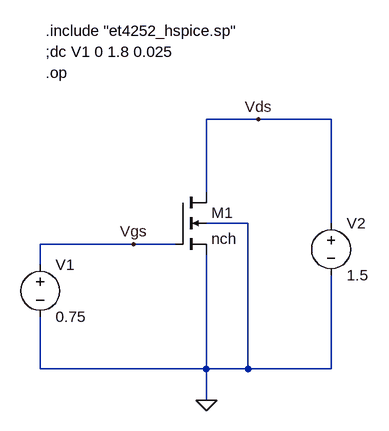
[diagram p0: schematic hw2.asc]
hw2.asc, the LTspice schematic file:
Version 4
SHEET 1 880 680
WIRE 176 64 96 64
WIRE 288 64 176 64
WIRE 96 176 96 64
WIRE 160 224 96 224
WIRE 288 224 288 64
WIRE -16 256 -160 256
WIRE 48 256 -16 256
WIRE -160 288 -160 256
WIRE -160 448 -160 368
WIRE 96 448 96 272
WIRE 96 448 -160 448
WIRE 160 448 160 224
WIRE 160 448 96 448
WIRE 288 448 288 304
WIRE 288 448 160 448
WIRE 96 496 96 448
FLAG 96 496 0
FLAG -16 256 Vgs
FLAG 176 64 Vds
SYMBOL nmos4 48 176 R0
SYMATTR InstName M1
SYMATTR Value nch
SYMATTR Value2 l=0.7u w=20u
SYMBOL voltage -160 272 R0
WINDOW 123 0 0 Left 0
WINDOW 39 0 0 Left 0
SYMATTR InstName V1
SYMATTR Value 0.75
SYMBOL voltage 288 208 R0
WINDOW 123 0 0 Left 0
WINDOW 39 0 0 Left 0
SYMATTR InstName V2
SYMATTR Value 1.5
TEXT -152 -72 Left 2 !.include "et4252_hspice.sp"
TEXT -152 -40 Left 2 !;dc V1 0 1.8 0.025
TEXT -152 -8 Left 2 !.op

The netlist it stands for:
* hw2.asc
M1 Vds Vgs 0 0 nch l=0.7u w=20u
V1 Vgs 0 0.75
V2 Vds 0 1.5
.model NMOS NMOS
.model PMOS PMOS
.lib standard.mos
.include "et4252_hspice.sp"
;dc V1 0 1.8 0.025
.op
.backanno
.end

* Results of the author's LTspice run, read from the files saved beside the schematic
* Operating Point:
*   V(vds) = 1.5 V
*   V(vgs) = 750 mV
*   Id(M1) = 357.7 µA
*   Ig(M1) = 0 A
*   Ib(M1) = -1.51 pA
*   Is(M1) = -357.7 µA
*   I(V2) = -357.7 µA
*   I(V1) = 0 A
* From the log:
*   Semiconductor Device Operating Points:
*                           --- BSIM3 MOSFETS ---
*   Name:        m1
*   Model:       nch
*   Id:        3.58e-04
*   Vgs:       7.50e-01
*   Vds:       1.50e+00
*   Vbs:       0.00e+00
*   Vth:       4.18e-01
*   Vdsat:     2.42e-01
*   Gm:        2.09e-03
*   Gds:       1.88e-05
*   Gmb        5.66e-04
*   Cbd:       0.00e+00
*   Cbs:       0.00e+00
*   Cgsov:     9.82e-15
*   Cgdov:     9.82e-15
*   Cgbov:     6.68e-19
*   dQgdVgb:   1.14e-13
*   dQgdVdb:  -9.38e-15
*   dQgdVsb:  -9.94e-14
*   dQddVgb:  -9.85e-15
*   dQddVdb:   9.83e-15
*   dQddVsb:   2.75e-17
*   dQbdVgb:  -1.92e-14
*   dQbdVdb:   5.24e-17
*   dQbdVsb:  -9.79e-15